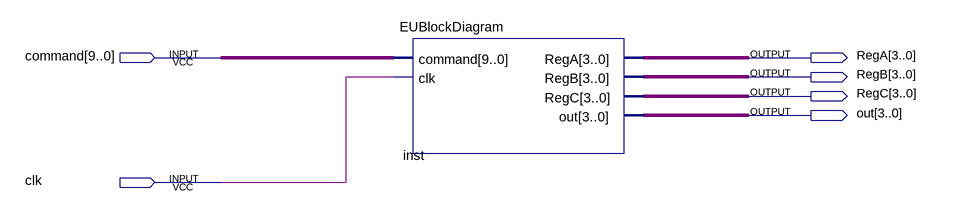
[diagram p0: schematic sheet]
// Quartus schematic EU.bdf as structural Verilog: 1 symbols, 6 pins
module EU (
  input  [9:0] command,
  input  clk,
  output [3:0] RegA,
  output [3:0] RegB,
  output [3:0] RegC,
  output [3:0] out
);

  EUBlockDiagram inst (.command(command), .clk(clk), .RegA(RegA), .RegB(RegB), .RegC(RegC), .out(out));
endmodule
